# EAGLE design riffleito-THPL-revA (EAGLE 6.5.0)
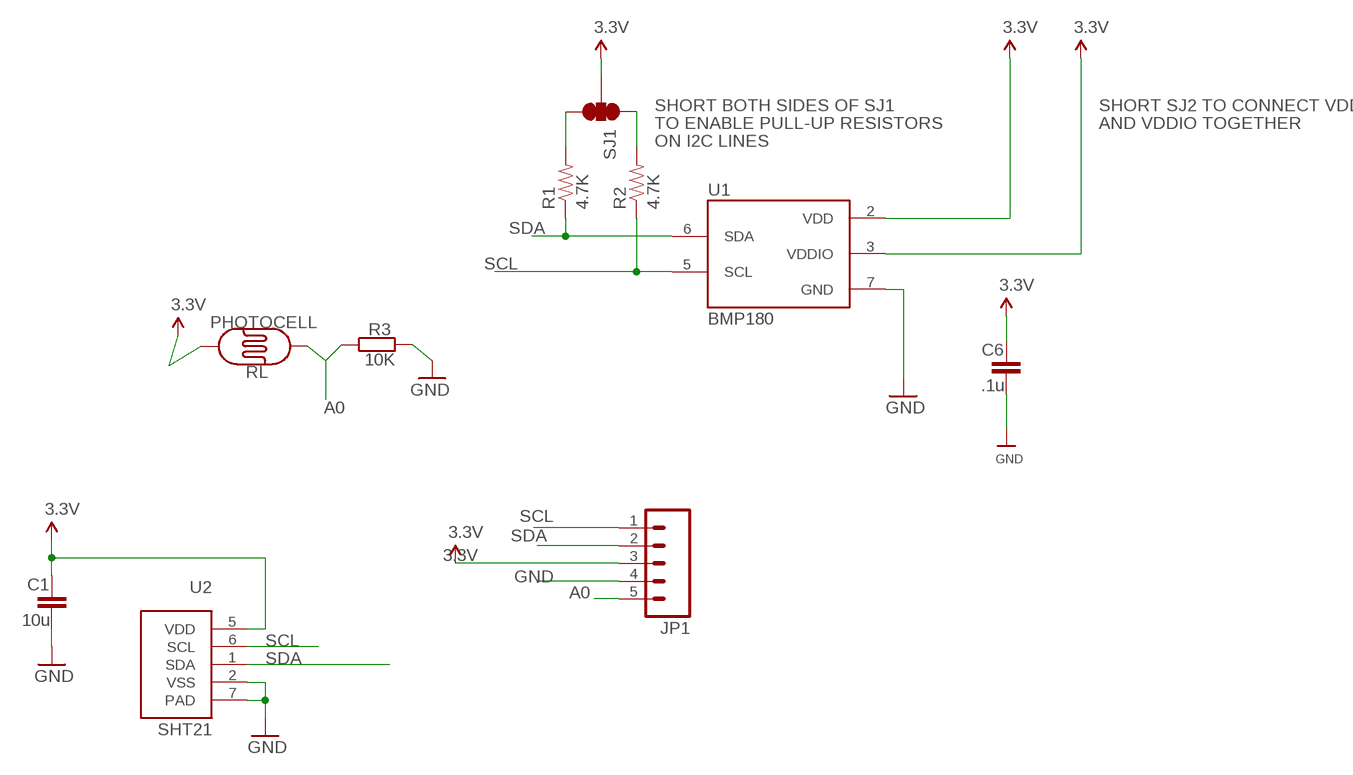
[diagram p0: schematic, sheet 1]

## Parts
C1  10u  C-EUC0805  [C0805]
C6  .1u  C-EUC0805  [C0805]
JP1  M05PTH  [1X05]
R1  4.7K  RESISTOR0603-RES  [0603-RES]
R2  4.7K  RESISTOR0603-RES  [0603-RES]
R3  10K  R-EU_R0805  [R0805]
RL  PHOTOCELL  PHOTOCELLPTH  [PHOTOCELL]
SJ1  SOLDERJUMPER_2WAYPASTE1&2&3  [SJ_3_PASTE1&2&3]
U1  BMP180  [BMP180]
U2  SHT21  SEN-SENSIRION-SHT2X  [SEN-SENSIRION-SHT2X]

## Nets
3.3V: C1.1 C6.1 JP1.3 RL.2 SJ1.2 U1.2(VDD) U1.3(VDDIO) U2.5(VDD)
A0: JP1.5 R3.1 RL.1
GND: C1.2 C6.2 JP1.4 R3.2 U1.7(GND) U2.2(VSS) U2.7(PAD)
N$1: R1.2 SJ1.3
N$2: R2.2 SJ1.1
SCL: JP1.1 R2.1 U1.5(SCL) U2.6(SCL)
SDA: JP1.2 R1.1 U1.6(SDA) U2.1(SDA)

## Notes on the sheet
- SHORT BOTH SIDES OF SJ1 | SHORT SJ2 TO CONNECT VDD
- TO ENABLE PULL-UP RESISTORS | AND VDDIO TOGETHER
- ON I2C LINES

## Library data of the parts
C1 C6 = resistor:C-EU: CAPACITOR, European symbol
JP1 = SparkFun-Connectors:M05: Header 5 Standard 5-pin 0.1" header. Use with straight break away headers (SKU : PRT-00116), right angle break away headers (PRT-00553), swiss pins (PRT-00743), machine pins (PRT-00117), and female headers (PRT-00115). Molex polarized connector foot print use with SKU : PRT-08230 with associated crimp pins and housings.
R1 R2 = SparkFun-Passives:RESISTOR: Resistor Basic schematic elements and footprints for 0603, 1206, and PTH resistors.
R3 = rcl:R-EU_: RESISTOR, European symbol
RL = SparkFunNew:PHOTOCELL: Photocell Also known as a CdS photoresistor. This is a low cost way to detect light levels. Resistance decreases with more incoming light. SparkFun SKU: SEN-09088
SJ1 = mike-temp:SOLDERJUMPER_2WAY: Solder Jumper 2 way solder jumper
U1 = SparkFun-Sensors:BMP180: BOSCH BMP180 DIGITAL BAROMETRIC PRESSURE SENSOR Web page: http://www.bosch-sensortec.com/en/homepage/products_3/environmental_sensors_1/bmp180_1/bmp180 Datasheet: http://ae-bst.resource.bosch.com/media/products/dokumente/bmp180/BST-BMP180-DS000-09.pdf The BMP180 is the function compatible successor of the BMP085, a new generation of high precision digital pressure sensors for consumer applications. The ultra-low power, low voltage electronics of the BMP180 is optimized for use in mobile phones, PDAs, GPS navigation devices and outdoor equipment. With a low altitude noise of merely 0.25m at fast conversion time, the BMP180 offers superior performance. The I2C interface allows for easy system integration with a microcontroller. The BMP180 is based on piezo-resistive technology for EMC robustness, high accuracy and linearity as well as long term stability. Key features: - Temperature measurement included - I2C interface - Fully calibrated - Pb-free, halogen-free and RoHS compliant, - MSL 1 Basic specs: Pressure range: 300 to 1100hPa (+9000m to -500m relating to sea level) Supply voltage: 1.8 to 3.6V (VDD), 1.62V to 3.6V (VDDIO) Package: LGA package with metal lid Small footprint: 3.6mm x 3.8mm Super-flat: 0.93mm height Low power: 5μA at 1 sample / sec. in standard mode Low noise: 0.06hPa (0.5m) in ultra low power mode, 0.02hPa (0.17m) advanced resolution mode Typical applications: - Enhancement of GPS navigation (dead-reckoning, slope detection, etc.) - In- and out-door navigation - Leisure and sports - Weather forecast - Vertical velocity indication (rise/sink speed)
U2 = Misenso:SEN-SENSIRION-SHT2X

## Net classes
0 default: width 0.254 mm, clearance 0.203 mm

## Board
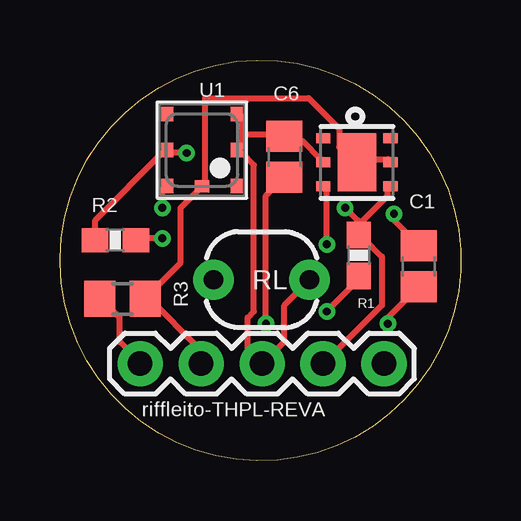
[diagram p1: board, top side]
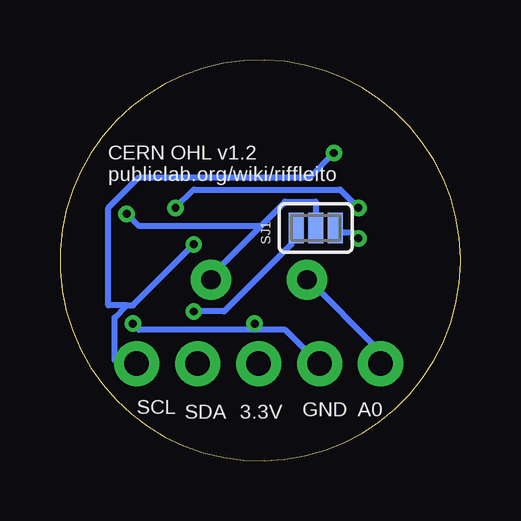
[diagram p2: board, bottom side, seen from below]

Size 16.69 x 16.7 mm. Coordinates in mm from the lower left corner, seen from the top.
Outline: 0,8.45 arc-359 0,8.25 0,8.45
Copper layers (1*16): Top 0.0356mm / dielectric 1.5011mm / Bottom 0.0356mm
Design rules "LaenPCBOrder": minimum track width 6mil, minimum drill 13mil, track to track 6mil, track to pad 6mil, pad to pad 6mil, via to via 6mil, smd to smd 6mil, copper to edge 15mil, drill to drill 6mil, minimum pad ring 7mil, minimum via ring 7mil, stop-mask expansion 3mil, vias tented up to drill 0mil, thermal gap 10mil

### Footprints (pad centres in the part's own frame; a part is rotated, then mirrored left to right if it is on the bottom)
C0805 = smd 1.3 x 1.5: 1 -0.85,0; 2 0.85,0
1X05 = drill 1.016 pad 1.88: 1 0,0; 2 2.54,0; 3 5.08,0; 4 7.62,0; 5 10.16,0
0603-RES = smd 1.1 x 1: 1 -0.85,0; 2 0.85,0
R0805 = smd 1.3 x 1.5: 1 -0.95,0; 2 0.95,0
PHOTOCELL = drill 0.8 pad 1.676: 1 -2,0; 2 2,0
SJ_3_PASTE1&2&3 = smd 0.635 x 1.27: 1 -0.813,0; 2 0,0; 3 0.813,0
BMP180 = smd 0.6 x 0.5: 1 1.5,1.45; 2 0,1.45; 3 -1.5,1.45; 4 -1.5,-1.45; 5 0,-1.45; 6 1.5,-1.45 | smd 0.5 x 0.6: 7 1.5,0
SEN-SENSIRION-SHT2X = smd 0.4 x 0.6: 1 -1,-1.4; 2 0,-1.4; 3 1,-1.4; 4 1,1.4; 5 0,1.4; 6 -1,1.4 | smd 2.4 x 1.6: 7 0,0

### Placement (x,y rotation side)
C1  14.95,8.11 270 top
C6  9.35,12.67 270 top
JP1  13.5,4.05 180 top
R1  12.45,8.56 270 top
R2  2.31,9.2 0 top
R3  2.6,6.75 0 top
RL  8.4,7.55 0 top
SJ1  6.04,9.7 180 bottom
U1  5.91,12.95 270 top
U2  12.37,12.44 90 top

### Tracks (layer width: path | path; a pad name or v marks a point on that pad's centre or on a via)
3.3V  (via drill 0.33)
  Top 0.254: v13.92,10.29 13.92,10.04 14.93,9.02 C1.1 | 7.57,13.59 7.57,14.35 U1.3 | 7.57,13.59 7.57,13.08 U1.2 7.57,12.83 8.07,12.32 8.07,6.23 7.82,5.97 7.82,4.7 8.33,4.19 JP1.3 8.58,4.19 9.34,4.96 9.34,6.48 10.36,7.5 RL.2 | U2.5 10.87,12.58 10.11,13.34 9.6,13.34 C6.1 9.34,13.59 7.57,13.59
  Bottom 0.254: 8.33,9.78 10.36,7.75 RL.2 | 8.33,9.78 7.31,10.8 6.04,10.8 6.04,9.78 SJ1.2 | v13.92,10.29 13.41,9.78 8.33,9.78
A0
  Top 0.254: R3.1 1.72,6.73 2.49,5.97 2.49,4.96 3.25,4.19 JP1.5
  Bottom 0.254: RL.1 6.3,7.5 3.5,4.7 3.5,4.19 JP1.5
GND  (via drill 0.33)
  Top 0.254: U2.2 13.66,12.58 12.39,12.58 U2.7 12.14,12.58 11.63,13.08 11.63,13.85 10.36,15.12 6.04,15.12 6.04,11.56 U1.7 5.79,11.31 5.03,10.54 5.03,8.26 3.76,6.99 R3.2 3.76,6.73 5.79,4.7 5.79,4.19 JP1.4 | v13.66,5.72 13.66,5.97 14.93,7.24 C1.2 | v8.58,5.72 8.58,11.05 C6.2
  Bottom 0.254: v13.66,5.72 13.41,5.46 8.58,5.46 | 8.58,5.46 7.31,5.46 6.04,4.19 JP1.4 | 8.58,5.46 v8.58,5.72
N$1  (via drill 0.33)
  Top 0.254: v11.12,6.23 12.39,7.5 R1.2
  Bottom 0.254: v11.12,6.23 9.85,6.23 7.06,9.02 7.06,9.53 SJ1.3
N$2  (via drill 0.33)
  Top 0.254: v4.26,9.27 3.25,9.27 R2.2
  Bottom 0.254: v4.26,9.27 4.52,9.53 5.03,9.53 SJ1.1
SCL  (via drill 0.33)
  Top 0.254: R2.1 1.47,9.27 1.47,10.04 4.26,12.83 U1.5 4.52,12.83 v5.28,12.83 | v11.12,9.02 11.12,11.31 U2.6
  Bottom 0.254: v11.12,9.02 13.66,6.48 13.92,6.48 | 13.92,6.48 14.42,5.97 14.42,4.19 13.66,4.19 JP1.1 | v5.28,12.83 6.3,11.81 13.41,11.81 14.68,10.54 14.68,6.48 13.92,6.48
SDA  (via drill 0.33)
  Top 0.254: v4.26,10.54 4.26,11.31 U1.6 | v11.88,10.54 12.39,10.04 12.39,9.78 | 12.39,9.78 12.39,9.53 R1.1 | 12.39,9.78 13.66,11.05 13.66,11.31 U2.1 | 12.39,9.78 R1.1 | JP1.2 11.12,4.19 13.41,6.48 13.41,8.51 12.65,9.27 R1.1
  Bottom 0.254: v4.26,10.54 5.03,11.31 11.12,11.31 v11.88,10.54

### Text on the board
tPlace: riffleito-THPL-REVA
bPlace: CERN OHL v1.2 | publiclab.org/wiki/riffleito | A0 | GND | 3.3V | SDA | SCL